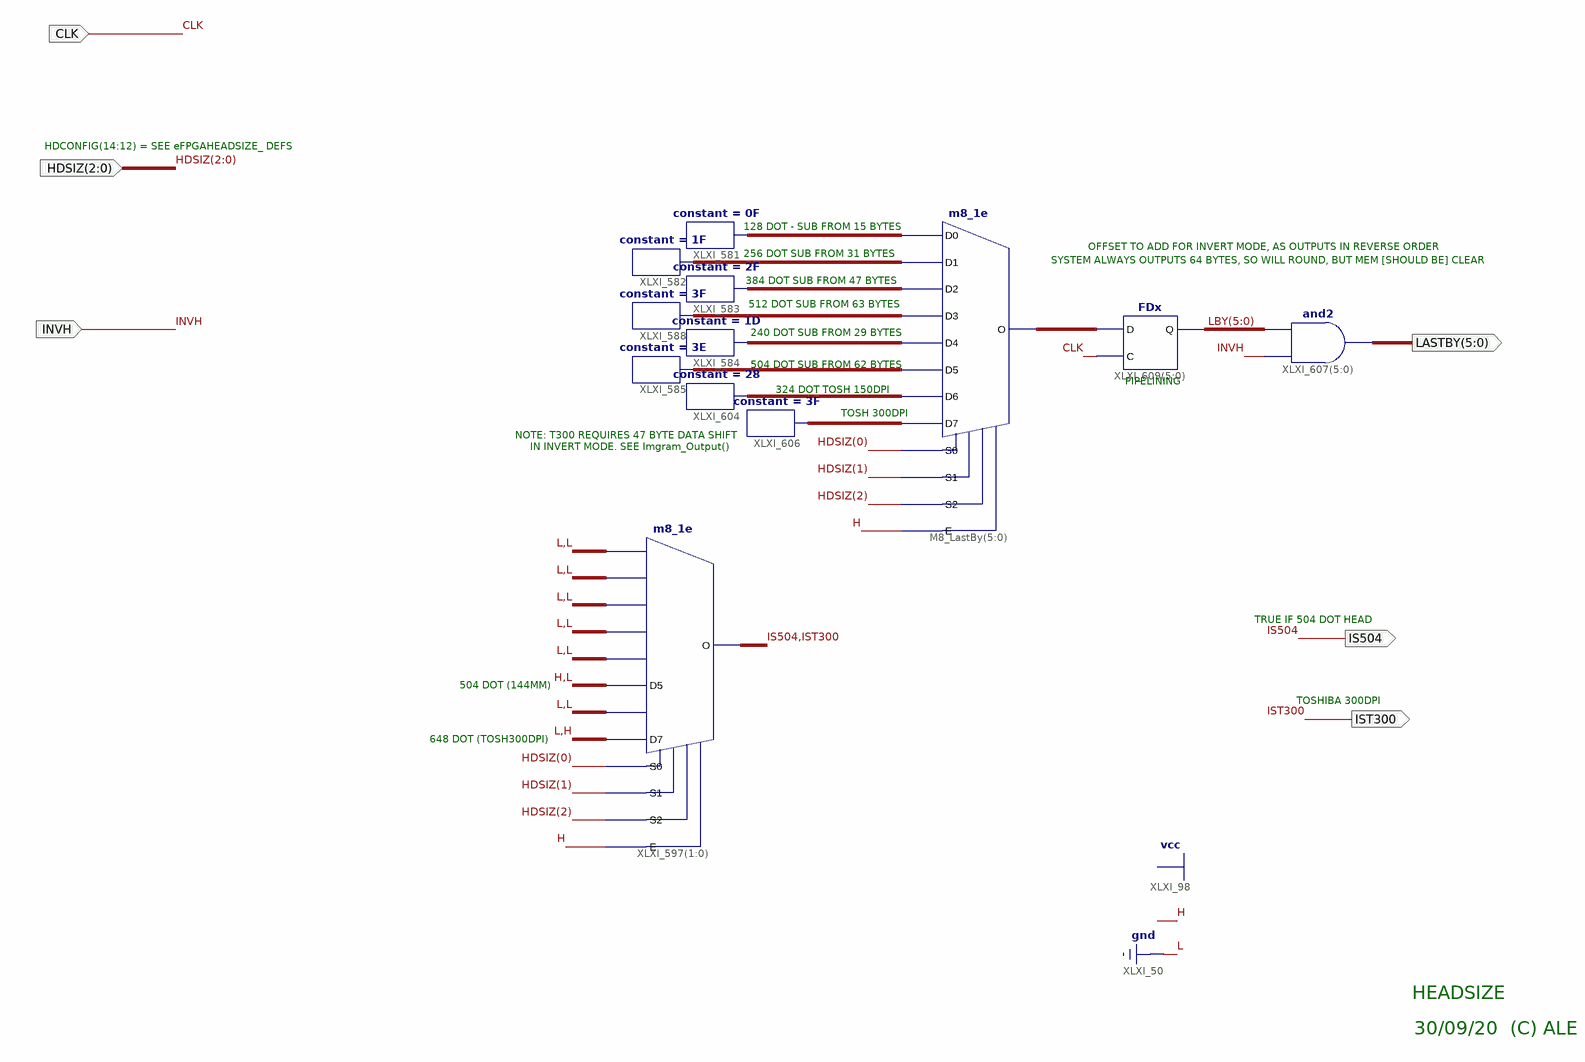
[diagram p0: schematic sheet 1]
// Xilinx ISE schematic HeadSize.sch (spartan3e) as structural Verilog: 12 symbols, 6 ports
module HeadSize (
  input  [2:0] HDSIZ,
  input  INVH,
  input  CLK,
  output IS504,
  output IST300,
  output [5:0] LASTBY
);

  wire [5:0] LBY, XLXN_7, XLXN_8, XLXN_9, XLXN_11, XLXN_12, XLXN_13, XLXN_59, XLXN_65, XLXN_77;

  constant #(.CValue("0F")) XLXI_581 (.O(XLXN_7));
  constant #(.CValue("1F")) XLXI_582 (.O(XLXN_8));
  constant #(.CValue("2F")) XLXI_583 (.O(XLXN_9));
  constant #(.CValue("3F")) XLXI_588 (.O(XLXN_11));
  constant #(.CValue("1D")) XLXI_584 (.O(XLXN_12));
  constant #(.CValue("3E")) XLXI_585 (.O(XLXN_13));
  m8_1e XLXI_597[1:0] (
    .D0(2'b00), .D1(2'b00), .D2(2'b00), .D3(2'b00), .D4(2'b00), .D5(2'b10), .D6(2'b00), .D7(2'b01), .E(1'b1),
    .S0(HDSIZ[0]), .S1(HDSIZ[1]), .S2(HDSIZ[2]), .O({IS504, IST300}));
  constant #(.CValue("28")) XLXI_604 (.O(XLXN_59));
  constant #(.CValue("3F")) XLXI_606 (.O(XLXN_65));
  m8_1e M8_LastBy[5:0] (
    .D0(XLXN_7), .D1(XLXN_8), .D2(XLXN_9), .D3(XLXN_11), .D4(XLXN_12), .D5(XLXN_13), .D6(XLXN_59),
    .D7(XLXN_65), .E(1'b1), .S0(HDSIZ[0]), .S1(HDSIZ[1]), .S2(HDSIZ[2]), .O(XLXN_77));
  FDx XLXI_609[5:0] (.C(CLK), .D(XLXN_77), .Q(LBY));
  assign LASTBY = {6{INVH}} & LBY;  // and2 XLXI_607[5..0], 6 bits wide

  // Notes on the sheet:
  //   HDCONFIG(14:12) = SEE eFPGAHEADSIZE_ DEFS
  //   128 DOT - SUB FROM 15 BYTES
  //   OFFSET TO ADD FOR INVERT MODE, AS OUTPUTS IN REVERSE ORDER
  //   256 DOT SUB FROM 31 BYTES
  //   SYSTEM ALWAYS OUTPUTS 64 BYTES, SO WILL ROUND, BUT MEM [SHOULD BE] CLEAR
  //   384 DOT SUB FROM 47 BYTES
  //   512 DOT SUB FROM 63 BYTES
  //   240 DOT SUB FROM 29 BYTES
  //   504 DOT SUB FROM 62 BYTES
  //   PIPELINING
  //   324 DOT TOSH 150DPI
  //   TOSH 300DPI
  //   NOTE: T300 REQUIRES 47 BYTE DATA SHIFT
  //   IN INVERT MODE. SEE Imgram_Output()
  //   TRUE IF 504 DOT HEAD
  //   504 DOT (144MM)
  //   TOSHIBA 300DPI
  //   648 DOT (TOSH300DPI)
  //   HEADSIZE
  //   30/09/20  (C) ALE
endmodule
